# Altium schematic sheet 3V3_LDO.SchDoc
size A; SheetNumber: 2; SheetTotal: 7
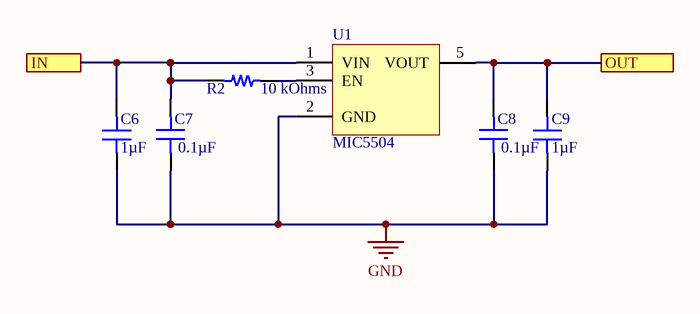
[diagram p0: 3V3_LDO.SchDoc]

## Parts
C6  1µF  [CAP 0603_1608]
C7  0.1µF  [CAP 0603_1608]
C8  0.1µF  [CAP 0603_1608]
C9  1µF  [CAP 0603_1608]
R2  10 kOhms  [RES 0603_1608]
U1  MIC5504  [TI SOT-23-5 DBV]

## Ports
IN, OUT

## Nets
GND: C6.1 C7.2 C8.2 C9.1 U1.2(GND)
IN: C6.2 C7.1 R2.2 U1.1(VIN) ; port IN
OUT: C8.1 C9.2 U1.5(VOUT) ; port OUT
NetR2_1: R2.1 U1.3(EN)

## Library data of the parts
C6 C9 = GCJ188R71E105KA01D: CAP CER 1UF 25V X7R 0603; Manufacturer: Murata Electronics; Tolerance: ±10%; Part Number: GCJ188R71E105KA01D; Value: 1µF; Applications: Automotive, Boardflex Sensitive; Capacitance: 1µF; ComponentLink1Description: Datasheet; ComponentLink1URL: https://search.murata.co.jp/Ceramy/image/img/A01X/G101/ENG/GCJ188R71E105KA01-01.pdf; ComponentLink2Description: DigiKey Link; ComponentLink2URL: http://digikey.com/product-detail/en/murata-electronics/GCJ188R71E105KA01D/490-14409-1-ND/6606870; Device Package: 0603 (1608 Metric); Features: Soft Termination; LastUpdated: 13-Aug-20 10:24:06 AM; Lifecycle Status: Active; Minimum Order: 1; Mounting Type: Surface Mount, MLCC; Operating Temperature: -55°C ~ 125°C; Package / Case: 0603 (1608 Metric); Packaging: TapeAndReel; PartId: 9566; Part Status: Active; Price: 0.05; Ratings: AEC-Q200; Series: GCJ; Size / Dimension: 0.063" L x 0.031" W (1.60mm x 0.80mm); Supplier 1: DigiKey; Supplier Part Number 1: 490-14409-1-ND; Temperature Coefficient: X7R; Thickness (Max): 0.035" (0.90mm)
C7 C8 = GCG188R92A104KA03D: CAP CER 0.1UF 100V 0603 EPOXY; Manufacturer: Murata Electronics; Temperature Coefficient: X8R; Tolerance: ±10%; Part Number: GCG188R92A104KA03D; Value: 0.1µF; Applications: Automotive; Capacitance: 0.1µF; ComponentLink1Description: Datasheet; ComponentLink1URL: https://search.murata.co.jp/Ceramy/image/img/A01X/G101/ENG/GCG188R92A104KA03-01.pdf; ComponentLink2Description: DigiKey Link; ComponentLink2URL: http://digikey.com/product-detail/en/murata-electronics/GCG188R92A104KA03D/490-18197-1-ND/9867926; Device Package: 0603 (1608 Metric); Features: Epoxy Mountable; LastUpdated: 21-Jan-20 12:01:59 AM; Lifecycle Status: Active; Minimum Order: 1; Mounting Type: Surface Mount, MLCC, Epoxy; Operating Temperature: -55°C ~ 150°C; Package / Case: 0603 (1608 Metric); Packaging: TapeAndReel; PartId: 9025; Part Status: Active; Price: 0.07; Ratings: AEC-Q200; Series: GCG; Size / Dimension: 0.063" L x 0.031" W (1.60mm x 0.80mm); Supplier 1: DigiKey; Supplier Part Number 1: 490-18197-1-ND; Thickness (Max): 0.035" (0.90mm); Voltage - Rated: 100V
R2 = RNCS0603BKE10K0: RES 10K OHM 0.1% 1/16W 0603; Manufacturer: Stackpole Electronics Inc; Power (Watts): 0.063W, 1/16W; Temperature Coefficient: ±25ppm/°C; Part Number: RNCS0603BKE10K0; Value: 10 kOhms; ComponentLink1Description: Datasheet; ComponentLink1URL: https://www.seielect.com/catalog/sei-rncs_rnch.pdf; ComponentLink2Description: DigiKey Link; ComponentLink2URL: http://digikey.com/product-detail/en/stackpole-electronics-inc/RNCS0603BKE10K0/RNCS0603BKE10K0CT-ND/1800113; Composition: Thin Film; Device Package: 0603 (1608 Metric); Features: Anti-Corrosive, Automotive AEC-Q200, Moisture Resistant; Height - Seated (Max): 0.022" (0.55mm); LastUpdated: 21-Jan-20 12:25:01 AM; Lifecycle Status: Active; Minimum Order: 1; Number of Terminations: 2; Operating Temperature: -55°C ~ 155°C; Package / Case: 0603 (1608 Metric); Packaging: TapeAndReel; PartId: 4838; Part Status: Active; Price: 0.08; Ratings: AEC-Q200; Resistance: 10 kOhms; Series: RNCS; Size / Dimension: 0.061" L x 0.031" W (1.55mm x 0.80mm); Supplier 1: DigiKey; Supplier Part Number 1: RNCS0603BKE10K0CT-ND; Supplier Device Package: 0603; Tolerance: ±0.1%
U1 = MIC5504-3.3YM5: 3.3V LDO